# Altium schematic sheet Sheet1.SchDoc
size A
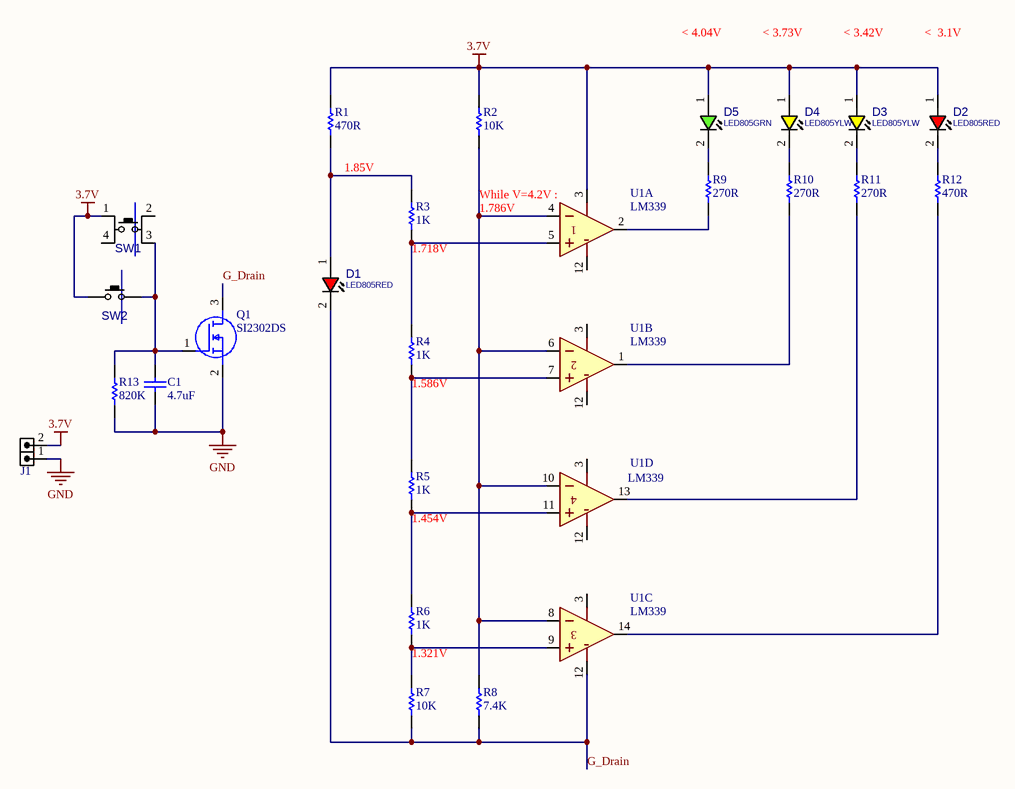
[diagram p0: Sheet1.SchDoc]

## Parts
C1  4.7uF  [CAP0805]
D1  LED805RED  [LED0805RED]
D2  LED805RED  [LED0805RED]
D3  LED805YLW  [LED0805YLW]
D4  LED805YLW  [LED0805YLW]
D5  LED805GRN  [LED0805GRN]
J1  HDRM2  [HDR_M_1X2]  (value not drawn)
Q1  SI2302DS  [SOT95P230X110-3N]
R1  470R  [RES0805]
R2  10K  [RES0805]
R3  1K  [RES0805]
R4  1K  [RES0805]
R5  1K  [RES0805]
R6  1K  [RES0805]
R7  10K  [RES0805]
R8  7.4K  [RES0805]
R9  270R  [RES0805]
R10  270R  [RES0805]
R11  270R  [RES0805]
R12  470R  [RES0805]
R13  820K  [RES0805]
SW1  PUSHBUTTON  [SWPBS_SPDT_4X4SKRM]  (value not drawn)
SW2  PUSHBUTTON  [SWPBS_SPST_6X3X2]  (value not drawn)
U1  LM339  [SO_14]  (parts A,B,C,D of 4)

## Nets
3.7V: D2.1(ANODE) D3.1(ANODE) D4.1(ANODE) D5.1(ANODE) J1.2 R1.2 R2.2 SW1.1(P1) SW2.1(P1) U1.3(V+)
GND: C1.1 J1.1 Q1.2(S) R13.1
G_Drain: D1.2(CATHODE) Q1.3(D) R7.1 R8.1 U1.12(V-)
NetC1_2: C1.2 Q1.1(G) R13.2 SW1.3(P4) SW2.2(P3)
NetD1_1: D1.1(ANODE) R1.1 R3.2
NetD2_2: D2.2(CATHODE) R12.2
NetD3_2: D3.2(CATHODE) R11.2
NetD4_2: D4.2(CATHODE) R10.2
NetD5_2: D5.2(CATHODE) R9.2
NetR2_1: R2.1 R8.2 U1.4(IN-) U1.6(IN-) U1.8(IN-) U1.10(IN-)
NetR3_1: R3.1 R4.2 U1.5(IN+)
NetR4_1: R4.1 R5.2 U1.7(IN+)
NetR5_1: R5.1 R6.2 U1.11(IN+)
NetR6_1: R6.1 R7.2 U1.9(IN+)
NetR9_1: R9.1 U1.2(OUT)
NetR10_1: R10.1 U1.1(OUT)
NetR11_1: R11.1 U1.13(OUT)
NetR12_1: R12.1 U1.14(OUT)

Not connected (* = marked no-connect by the designer): SW1 2(P3) 4(P2)

## Notes on the sheet
- < 4.04V
- < 3.73V
- < 3.42V
- <  3.1V
- 1.85V
- (near R3) 1.718V
- 1.786V
- (near U1) While V=4.2V :
- (near R4) 1.586V
- (near R5) 1.454V
- (near R6) 1.321V

## Library data of the parts
C1 = CAP SMD PACKAGE: TOTAL CAPACITOR SMD PACK; Designer: Abbas Basereh; Desc.: CAP SMD TOTAL PACKAGES; VALUE: 100nF; Data: 2017-3-10
D1 D2 = LED_SMD_0805_RED: LED, SMD, 0805, RED; DESC: DESCRIPTION; MANF_P#: MANF_PART#; PARAM2: 2.2V; MANF: MANF; ASSEMBLY: ASSEMBLY; PRICE: 36t@Javan; VALUE: LED805RED
D3 D4 = LED_SMD_0805_YLW: LED, SMD, 0805, YELLOW; DESC: DESCRIPTION; MANF_P#: MANF_PART#; PARAM2: 2.2V; MANF: MANF; ASSEMBLY: ASSEMBLY; PRICE: 36t@Javan; VALUE: LED805YLW
D5 = LED_SMD_0805_GRN: LED, SMD, 0805, GREEN; PARAM: 20mA; DESC: DESCRIPTION; PARAM2: 2.2V; MANF: -; ASSEMBLY: ASSEMBLY; PRICE: 36t@Javan; MANF_P#: -; VALUE: LED805GRN
J1 = HDR_M_1X2: CONN, HEADER, Male, pitch: 2.54mm, 2POS; VALUE: HDRM2
Q1 = SI2302DS: MOSFET (N-Channel); Manufacturer_Name: Nexperia; Datasheet Link: https://assets.nexperia.com/documents/data-sheet/SI2302DS.pdf; Height: 1.1mm; Manufacturer_Part_Number: SI2302DS; Mouser Part Number: N/A; Mouser Price/Stock: https://www.mouser.com/Search/Refine.aspx?Keyword=N%2FA
R1-R13 = RES SMD PACKAGE: TOTAL SMD RESISTOR PACK; Designer: Abbas Basereh; Desc.: RES SMD PAKAGES; Data: 2017-3-10
SW1 = SWPBS_SPDT_4X4_SKRMAAE010: SWITCH, PUSH BUTTON, TACTILE, SMD, SPDT, 4X4MM; MANF: ALPS; DESC: DESCRIPTION; VALUE: PUSHBUTTON; ASSEMBLY: ASSEMBLY; PARAM: PARAM; PRICE: PRICE; MANF_P#: SKRMAAE010
SW2 = SWPBS_SPST_6X3X2_RS282: SWITCH, PUSH BUTTON, TACTILE, SMD, SPST, 6X3.5X2.5mm; MANF: C&K; DESC: DESCRIPTION; MANF_P#: RS-282G05A3-SM RT; VALUE: PUSHBUTTON; ASSEMBLY: ASSEMBLY; PARAM: PARAM; PRICE: 0.8$
U1 = LM339_SOP14: Comparator, Quad; MANF: ST, Texas Instruments, ON; MANF_P#: LM339DT, LM339ADT, LM339MX, LM339AMX, LM339M, LM339AM, LM339DR2G; PARAM2: +2~+36 V, ±1~±18V; VALUE: LM339